# Altium schematic sheet PowerBoard_PowerDiagram.SchDoc
size A; SheetNumber: 1; SheetTotal: 4
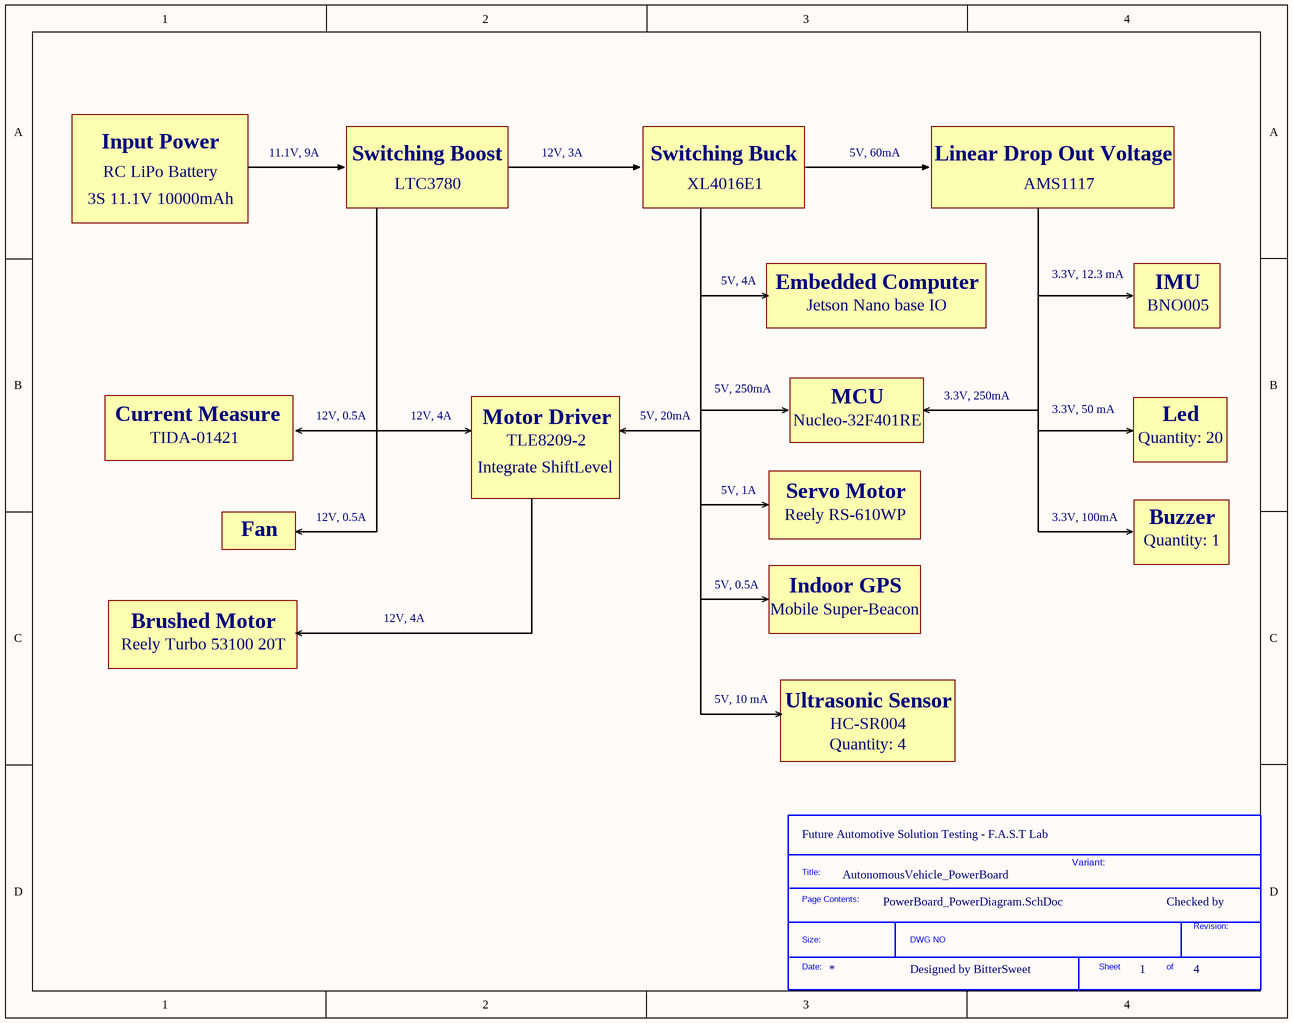
[diagram p0: PowerBoard_PowerDiagram.SchDoc]

## Parts
*?  SDTitleBlock  (value not drawn)  (graphical)

## Notes on the sheet
- Input Power
- 11.1V, 9A
- Switching Boost
- 12V, 3A
- Switching Buck
- 5V, 60mA
- Linear Drop Out Voltage
- 3S 11.1V 10000mAh
- RC LiPo Battery
- LTC3780
- XL4016E1
- AMS1117
- 5V, 4A
- Embedded Computer
- 3.3V, 12.3 mA
- IMU
- Jetson Nano base IO
- BNO005
- Current Measure
- 12V, 0.5A
- 12V, 4A
- Motor Driver
- 5V, 20mA
- 5V, 250mA
- Nucleo-32F401RE
- MCU
- 3.3V, 250mA
- 3.3V, 50 mA
- Led
- TIDA-01421
- Integrate ShiftLevel
- TLE8209-2
- 5V, 1A
- Servo Motor
- Quantity: 20
- Fan
- Reely RS-610WP
- 3.3V, 100mA
- Quantity: 1
- Buzzer
- Brushed Motor
- 5V, 0.5A
- Mobile Super-Beacon
- Indoor GPS
- Reely Turbo 53100 20T
- 5V, 10 mA
- Ultrasonic Sensor
- Quantity: 4
- HC-SR004
- (near *?) Future Automotive Solution Testing - F.A.S.T Lab
- AutonomousVehicle_PowerBoard
- Variant:
- Checked by
- Designed by BitterSweet
- (in symbol SDTitleBlock) Title:; Page Contents:; Revision:; Size:; DWG NO; Date:; Sheet; of